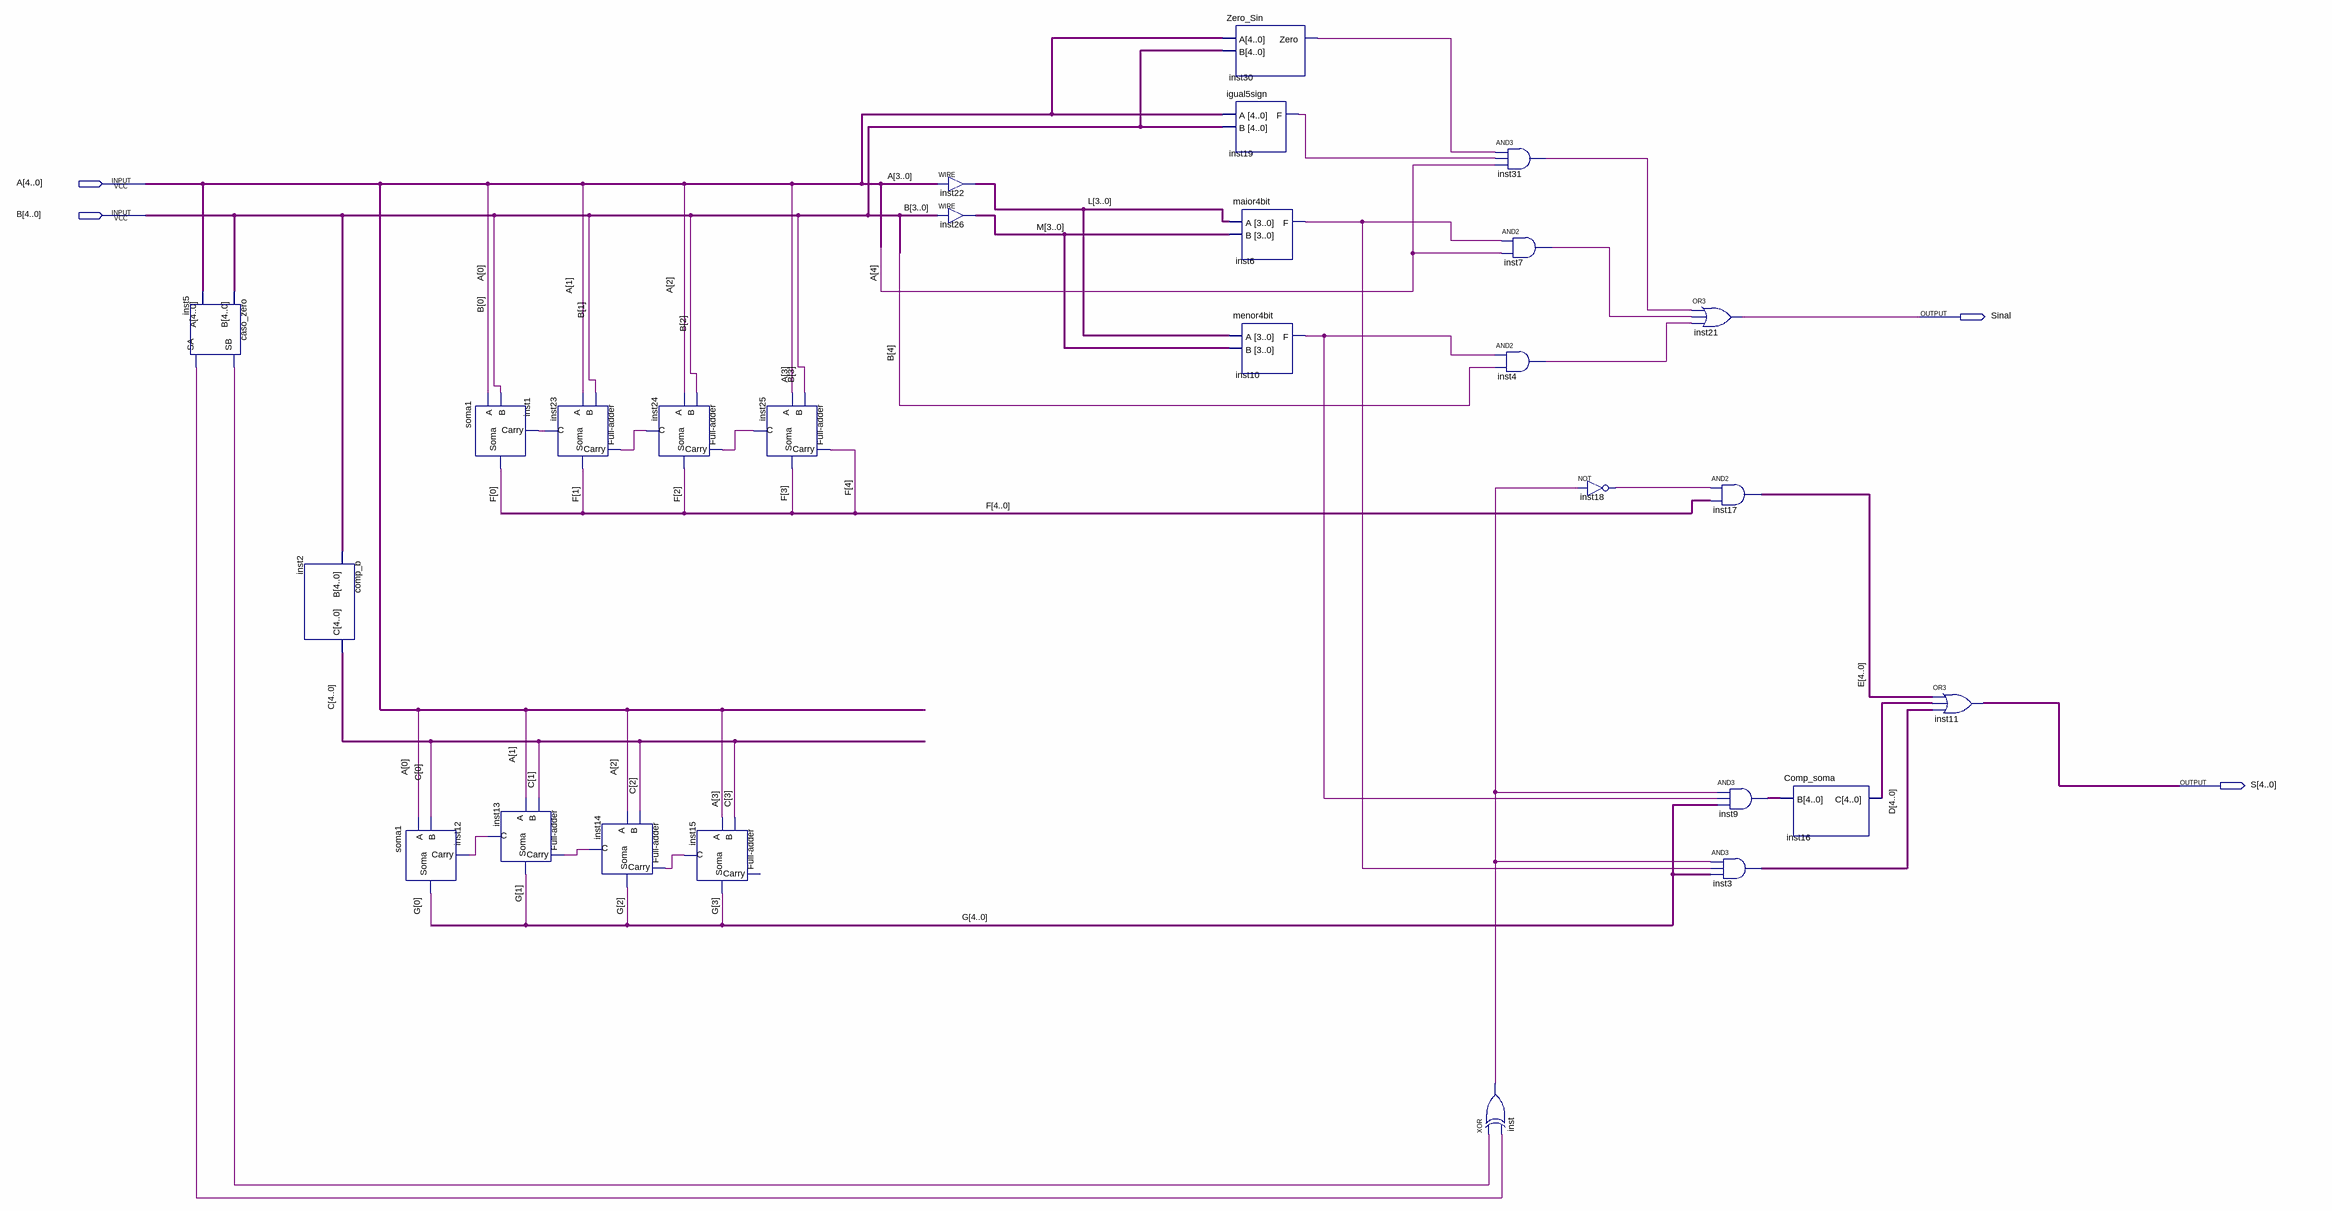
[diagram p0: schematic sheet]
// Quartus schematic Soma_AB.bdf as structural Verilog: 27 symbols, 4 pins
module Soma_AB (
  input  [4:0] A,
  input  [4:0] B,
  output Sinal,
  output [4:0] S
);

  wire inst1_carry, inst4_out, inst5_sa, inst5_sb, inst6_f, inst7_out, inst10_f, inst12_carry, inst13_carry,
       inst14_carry, inst18_out, inst19_f, inst23_carry, inst24_carry, inst30_zero, inst31_out, inst_out;
  wire [3:0] L, M;
  wire [4:0] C, D, E, F, G, inst9_out, inst16_c;

  caso_zero inst5 (.B(B), .A(A), .SA(inst5_sa), .SB(inst5_sb));
  comp_b inst2 (.B(B), .C(C));
  soma1 inst12 (.A(A[0]), .B(C[0]), .Carry(inst12_carry), .Soma(G[0]));
  soma1 inst1 (.A(A[0]), .B(B[0]), .Carry(inst1_carry), .Soma(F[0]));
  \Full-adder  inst13 (.B(C[1]), .A(A[1]), .C(inst12_carry), .Carry(inst13_carry), .Soma(G[1]));
  \Full-adder  inst23 (.B(B[1]), .A(A[1]), .C(inst1_carry), .Carry(inst23_carry), .Soma(F[1]));
  \Full-adder  inst14 (.B(C[2]), .A(A[2]), .C(inst13_carry), .Carry(inst14_carry), .Soma(G[2]));
  \Full-adder  inst24 (.B(B[2]), .A(A[2]), .C(inst23_carry), .Carry(inst24_carry), .Soma(F[2]));
  \Full-adder  inst15 (.B(C[3]), .A(A[3]), .C(inst14_carry), .Soma(G[3]));  // open: Carry
  \Full-adder  inst25 (.B(B[3]), .A(A[3]), .C(inst24_carry), .Carry(F[4]), .Soma(F[3]));
  assign L = A[3:0];  // WIRE inst22
  assign M = B[3:0];  // WIRE inst26
  Zero_Sin inst30 (.A(A), .B(B), .Zero(inst30_zero));
  igual5sign inst19 (.A(A), .B(B), .F(inst19_f));
  maior4bit inst6 (.A(L), .B(M), .F(inst6_f));
  menor4bit inst10 (.A(L), .B(M), .F(inst10_f));
  and inst31 (inst31_out, inst30_zero, inst19_f, A[4]);
  and inst7 (inst7_out, inst6_f, A[4]);
  and inst4 (inst4_out, inst10_f, B[4]);
  xor inst (inst_out, inst5_sb, inst5_sa);
  not inst18 (inst18_out, inst_out);
  or inst21 (Sinal, inst31_out, inst7_out, inst4_out);
  assign E = {5{inst18_out}} & F;  // AND2 inst17, 5 bits wide
  assign inst9_out = {5{inst_out}} & {5{inst10_f}} & G;  // AND3 inst9, 5 bits wide
  assign D = {5{inst_out}} & {5{inst6_f}} & G;  // AND3 inst3, 5 bits wide
  Comp_soma inst16 (.B(inst9_out), .C(inst16_c));
  assign S = E | inst16_c | D;  // OR3 inst11, 5 bits wide
endmodule
